# Altium schematic sheet schematic.SchDoc
size 594 x 420 mm
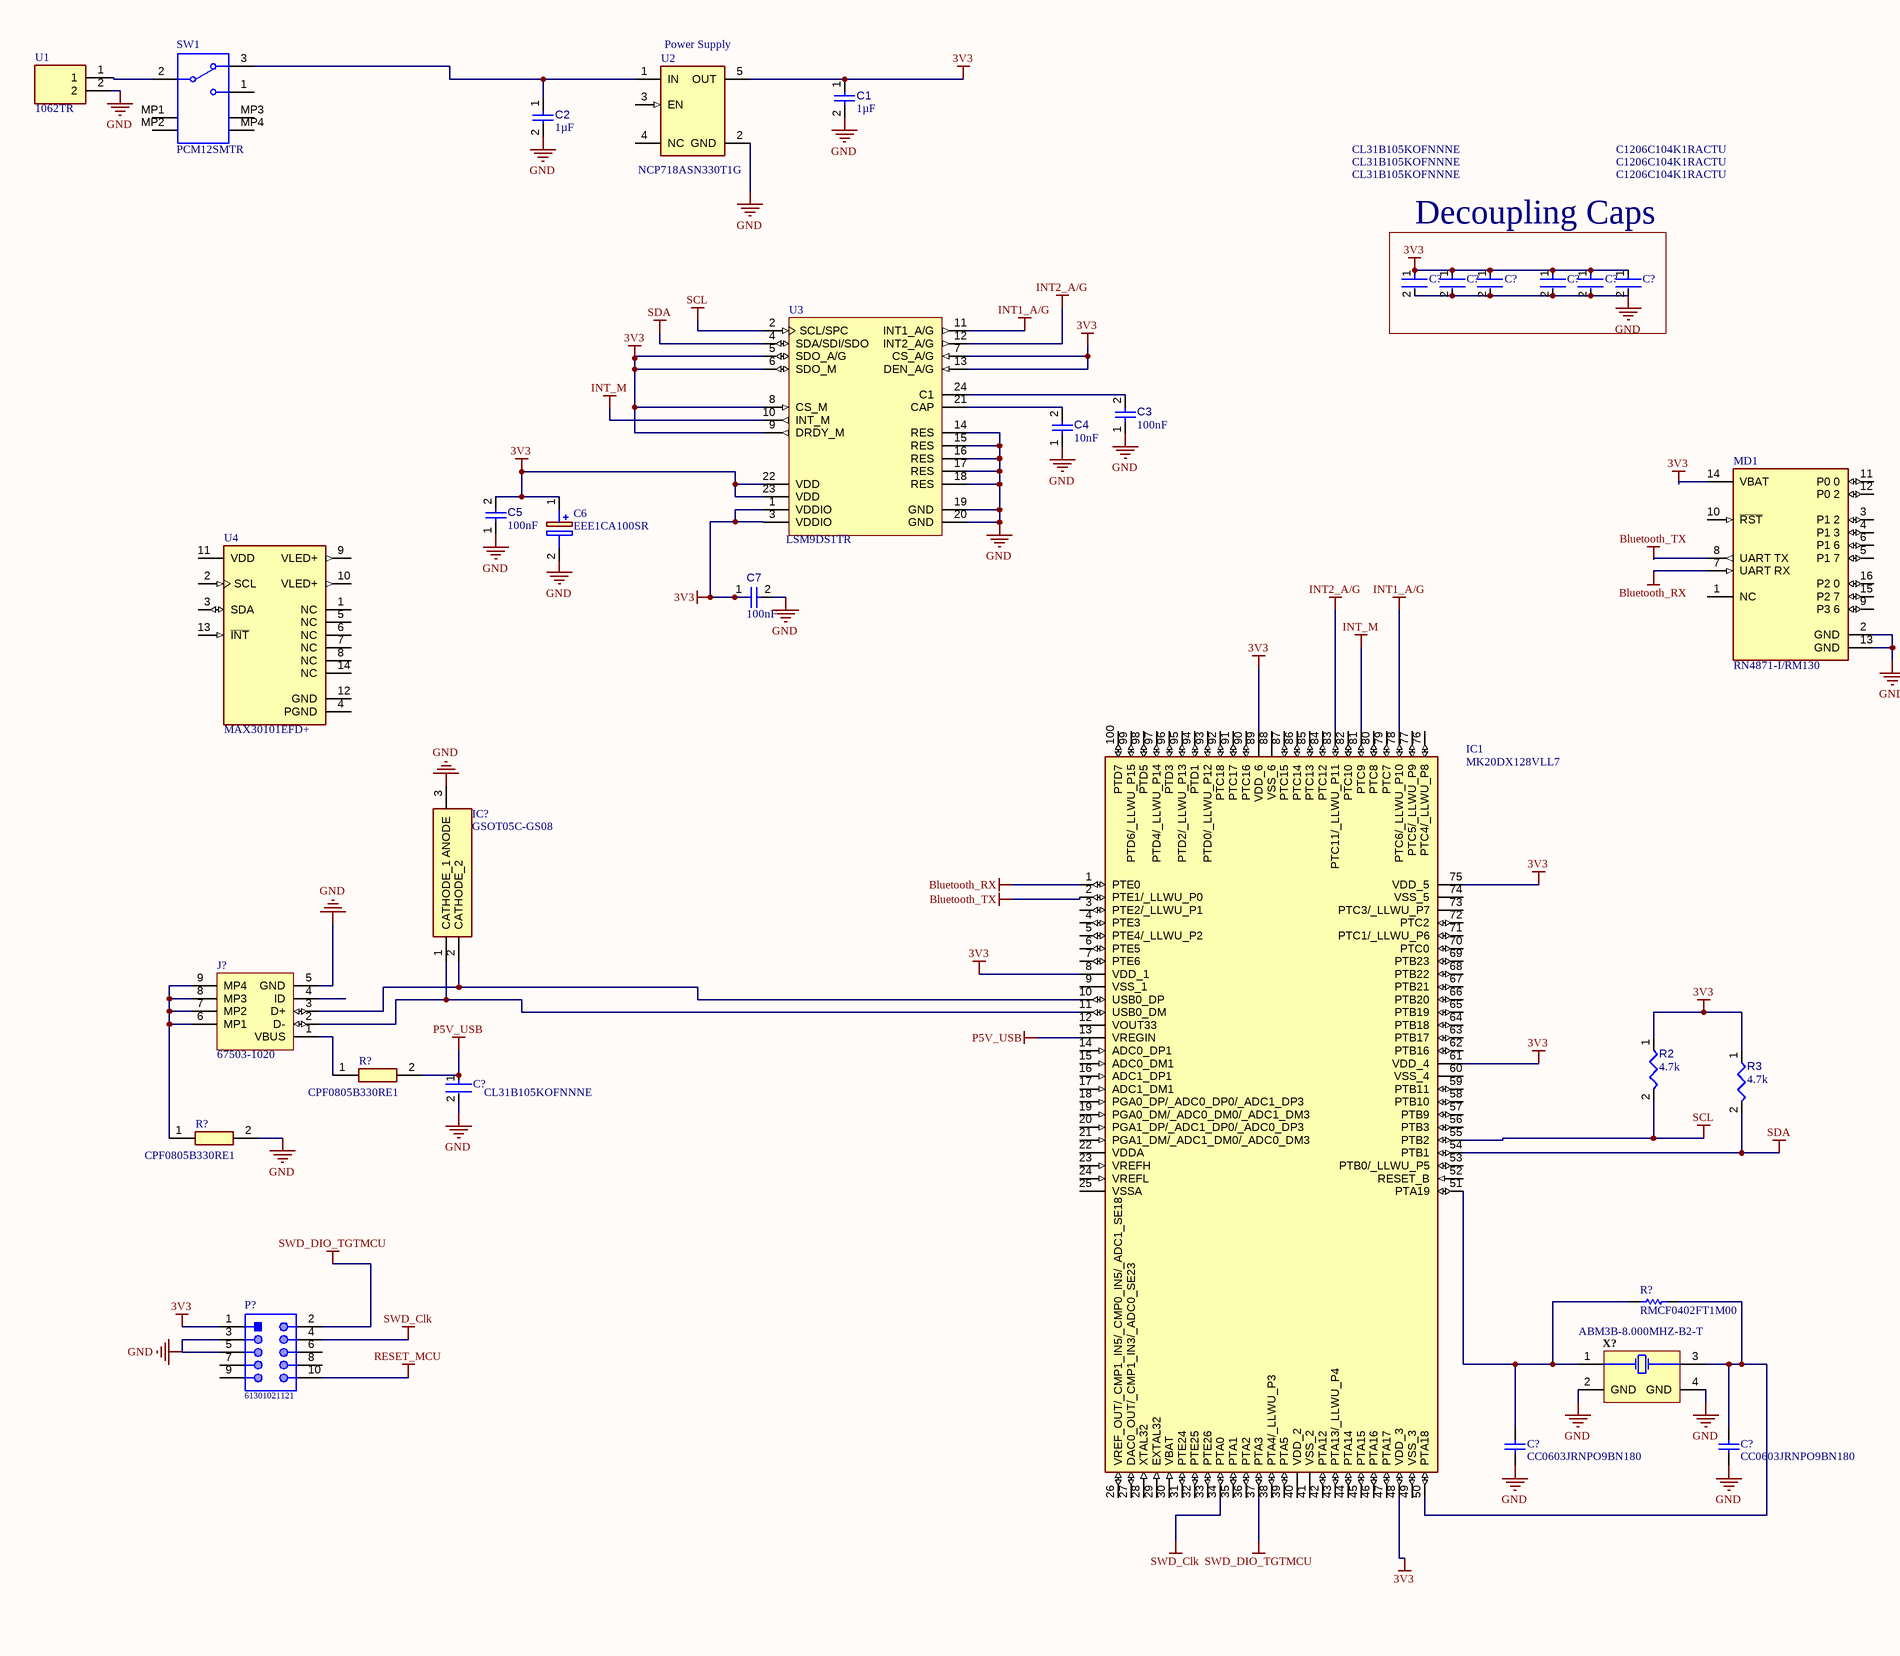
[diagram p0: schematic.SchDoc, left]
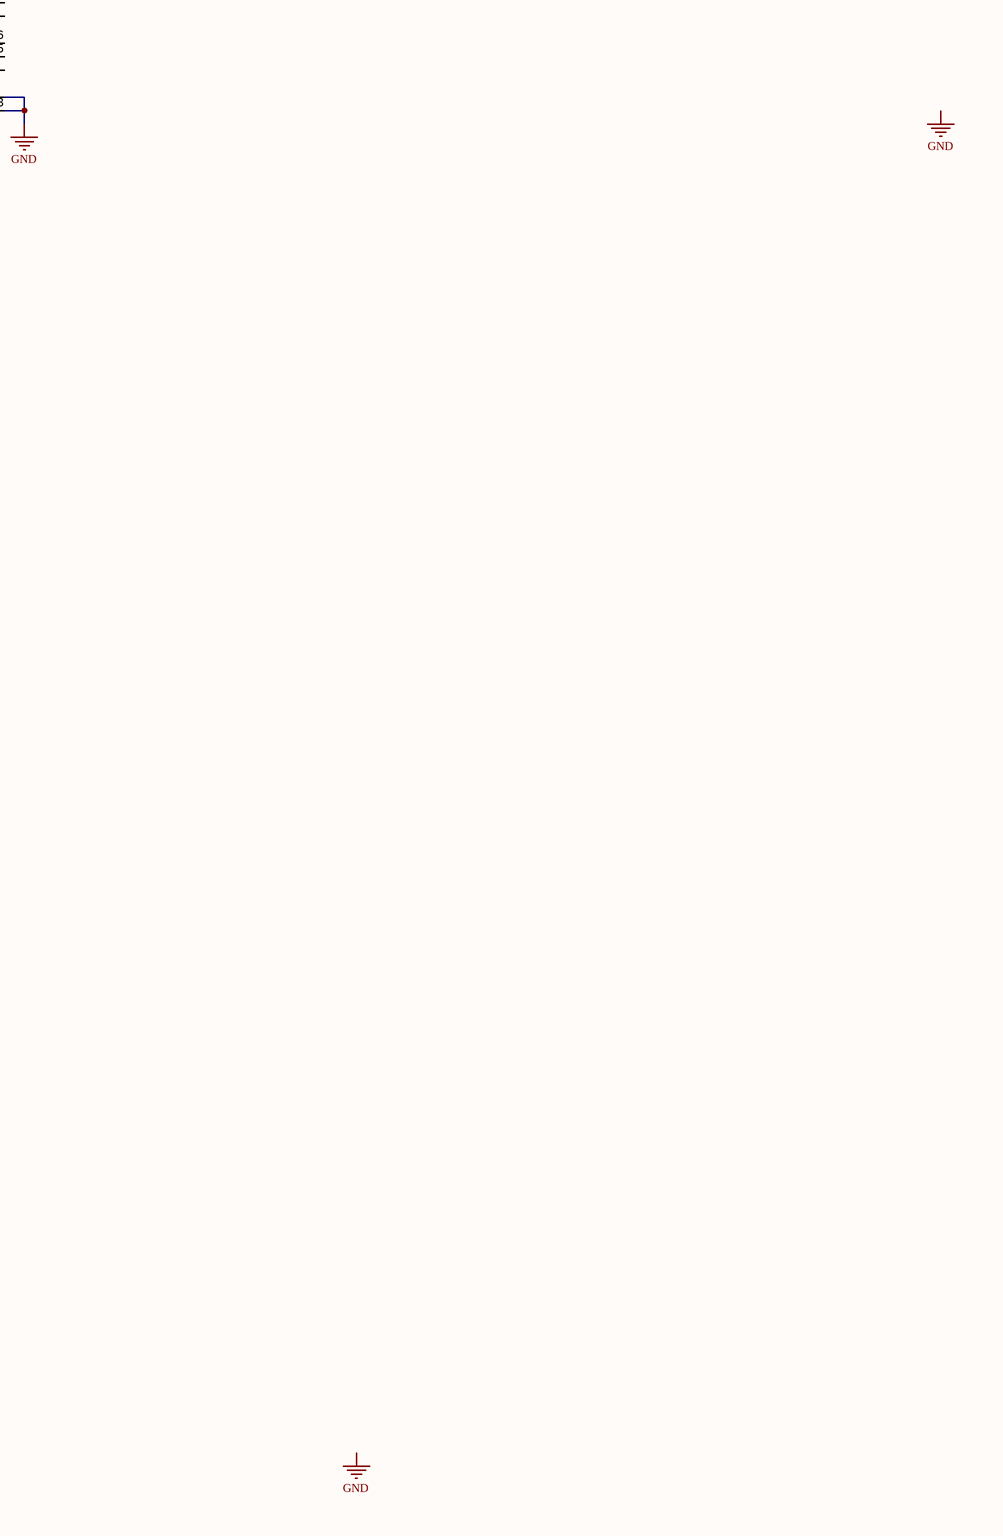
[diagram p1: schematic.SchDoc, right]

## Parts
(Parts that share a designator on the sheet are numbered #1, #2 ... from top to bottom, then left to right.)
C1  value 1µF  [CAPC1608X90X35ML15T15]  (hidden comment: Capacitor 1uF +/- 10% 16V 0603)
C2  value 1µF  [CAPC1608X90X35ML15T15]  (hidden comment: Capacitor 1uF +/- 10% 16V 0603)
C3  value 100nF  [CAPC1608X90X40ML10T20]  (hidden comment: Capacitor 100 nF +/-10% 50 V 0603)
C4  value 10nF  [CAPC0402(1005)60_L]  (hidden comment: Capacitor 10nF +/-20% 50V 0402)
C5  value 100nF  [CAPC1608X90X40ML10T20]  (hidden comment: Capacitor 100 nF +/-10% 50 V 0603)
C6  EEE1CA100SR  [CAPAE430X550N]
C7  value 100nF  [CAPC1608X90X40ML10T20]  (hidden comment: Capacitor 100 nF +/-10% 50 V 0603)
C?#1  CL31B105KOFNNNE  [FP-CL31-IPC_C]
C?#2  CL31B105KOFNNNE  [FP-CL31-IPC_C]
C?#3  CL31B105KOFNNNE  [FP-CL31-IPC_C]
C?#4  C1206C104K1RACTU  [FP-C1206C-EB-MFG]
C?#5  C1206C104K1RACTU  [FP-C1206C-EB-MFG]
C?#6  C1206C104K1RACTU  [FP-C1206C-EB-MFG]
C?#7  CL31B105KOFNNNE  [FP-CL31-IPC_C]
C?#8  CC0603JRNPO9BN180  [CAPC1608X90X40LL10T20]
C?#9  CC0603JRNPO9BN180  [CAPC1608X90X40LL10T20]
IC1  MK20DX128VLL7  [QFP50P1600X1600X170-100N]
IC?  GSOT05C-GS08  [SOT95P248X115-3N]
J?  67503-1020  [MOLX-67503-1020_V]
MD1  RN4871-I/RM130  [FP-RN4871-I-RM130-MFG]
P?  61301021121  [61301021121]
R2  value 4.7k  [RESC1608X55X25ML10T15]  (hidden comment: Resistor 4k7 +/-1% 0603 100 mW)
R3  value 4.7k  [RESC1608X55X25ML10T15]  (hidden comment: Resistor 4k7 +/-1% 0603 100 mW)
R?#1  CPF0805B330RE1  [RESC2012X65N]
R?#2  CPF0805B330RE1  [RESC2012X65N]
R?#3  RMCF0402FT1M00  [RESC1005X40X25LL10T15]
SW1  PCM12SMTR  [CKCP-PCM12SMTR_V]
U1  1062TR  [1062TR]
U2  NCP718ASN330T1G  [FP-419AE-01-IPC_C]
U3  LSM9DS1TR  [STM-LGA-24_3500X3000X1000]
U4  MAX30101EFD+  [FP-F143A5-1-MFG]
X?  ABM3B-8.000MHZ-B2-T  [ABRA-ABM3B_V]

## Blocks framed on the sheet
Decoupling Caps: C?#1-C?#6

## Nets
3V3: C1.1 C5.2 C6.1(+) C7.1 C?#1.1 C?#2.1 C?#3.1 C?#4.1 C?#5.1 C?#6.1 IC1.8(VDD_1) IC1.48(VDD_3) IC1.61(VDD_4) IC1.75(VDD_5) IC1.89(VDD_6) MD1.14(VBAT) P?.1 R2.1 R3.1 U2.5(OUT) U3.1(VDDIO) U3.3(VDDIO) U3.5(SDO_A/G) U3.6(SDO_M) U3.7(CS_A/G) U3.8(CS_M) U3.9(DRDY_M) U3.13(DEN_A/G) U3.22(VDD) U3.23(VDD)
Bluetooth_RX: IC1.1(PTE0) MD1.7(UART_RX)
Bluetooth_TX: IC1.2(PTE1/_LLWU_P0) MD1.8(UART_TX)
GND: C1.2 C2.2 C3.1 C4.1 C5.1 C7.2 C?#1.2 C?#2.2 C?#3.2 C?#4.2 C?#5.2 C?#6.2 C?#7.2 C?#8.1 C?#9.1 J?.5(GND) MD1.2(GND) MD1.13(GND) P?.3 P?.5 R?#2.2 U1.2 U2.2(GND) U3.14(RES) U3.15(RES) U3.16(RES) U3.17(RES) U3.18(RES) U3.19(GND) U3.20(GND) X?.2(GND) X?.4(GND)
INT1_A/G: IC1.78(PTC6/_LLWU_P10) U3.11(INT1_A/G)
INT2_A/G: IC1.83(PTC11/_LLWU_P11) U3.12(INT2_A/G)
INT_M: IC1.81(PTC9) U3.10(INT_M)
P5V_USB: C?#7.1 IC1.13(VREGIN) R?#1.2
RESET_MCU: P?.10
SCL: IC1.55(PTB2) R2.2 U3.2(SCL/SPC)
SDA: IC1.54(PTB1) R3.2 U3.4(SDA/SDI/SDO)
SWD_Clk: IC1.34(PTA0) P?.4
SWD_DIO_TGTMCU: IC1.37(PTA3) P?.2
NetC2_1: C2.1 SW1.3 U2.1(IN)
NetC3_2: C3.2 U3.24(C1)
NetC4_2: C4.2 U3.21(CAP)
NetC?#8_2: C?#8.2 IC1.51(PTA19) R?#3.1 X?.1(X1)
NetC?#9_2: C?#9.2 IC1.50(PTA18) R?#3.2 X?.3(X2)
NetIC1_10: IC1.10(USB0_DP) IC?.2(CATHODE_2) J?.3(D+)
NetIC1_11: IC1.11(USB0_DM) IC?.1(CATHODE_1) J?.2(D-)
NetJ?_1: J?.1(VBUS) R?#1.1
NetJ?_6: J?.6(MP1) J?.7(MP2) J?.8(MP3) J?.9(MP4) R?#2.1
NetSW1_2: SW1.2 U1.1

Not connected (* = marked no-connect by the designer): C6 2(-); IC1 3(PTE2/_LLWU_P1) 4(PTE3) 5(PTE4/_LLWU_P2) 6(PTE5) 7(PTE6) 9(VSS_1) 12(VOUT33) 14(ADC0_DP1) 15(ADC0_DM1) 16(ADC1_DP1) 17(ADC1_DM1) 18(PGA0_DP/_ADC0_DP0/_ADC1_DP3) 19(PGA0_DM/_ADC0_DM0/_ADC1_DM3) 20(PGA1_DP/_ADC1_DP0/_ADC0_DP3) 21(PGA1_DM/_ADC1_DM0/_ADC0_DM3) 22(VDDA) 23(VREFH) 24(VREFL) 25(VSSA) 26(VREF_OUT/_CMP1_IN5/_CMP0_IN5/_ADC1_SE18) 27(DAC0_OUT/_CMP1_IN3/_ADC0_SE23) 28(XTAL32) 29(EXTAL32) 30(VBAT) 31(PTE24) 32(PTE25) 33(PTE26) 35(PTA1) 36(PTA2) 38(PTA4/_LLWU_P3) 39(PTA5) 40(VDD_2) 41(VSS_2) 42(PTA12) 43(PTA13/_LLWU_P4) 44(PTA14) 45(PTA15) 46(PTA16) 47(PTA17) 49(VSS_3) 52(RESET_B) 53(PTB0/_LLWU_P5) 56(PTB3) 57(PTB9) 58(PTB10) 59(PTB11) 60(VSS_4) 62(PTB16) 63(PTB17) 64(PTB18) 65(PTB19) 66(PTB20) 67(PTB21) 68(PTB22) 69(PTB23) 70(PTC0) 71(PTC1/_LLWU_P6) 72(PTC2) 73(PTC3/_LLWU_P7) 74(VSS_5) 76(PTC4/_LLWU_P8) 77(PTC5/_LLWU_P9) 79(PTC7) 80(PTC8) 82(PTC10) 84(PTC12) 85(PTC13) 86(PTC14) 87(PTC15) 88(VSS_6) 90(PTC16) 91(PTC17) 92(PTC18) 93(PTD0/_LLWU_P12) 94(PTD1) 95(PTD2/_LLWU_P13) 96(PTD3) 97(PTD4/_LLWU_P14) 98(PTD5) 99(PTD6/_LLWU_P15) 100(PTD7); IC? 3(ANODE); J? 4(ID); MD1 1(NC) 3(P1_2) 4(P1_3) 5(P1_7) 6(P1_6) 9(P3_6) 10(~{RST}) 11(P0_0) 12(P0_2) 15(P2_7) 16(P2_0); P? 6 7 8 9; SW1 1 MP1 MP2 MP3 MP4; U2 3(EN) 4(NC); U4 1(NC) 2(SCL) 3(SDA) 4(PGND) 5(NC) 6(NC) 7(NC) 8(NC) 9(VLED+) 10(VLED+) 11(VDD) 12(GND) 13(~{INT}) 14(NC)

## Notes on the sheet
- (near U2) Power Supply
- Labels drawn without touching a wire or pin: GND
- 10
- 9
- 8
- 7
- 6
- 5
- 4
- 3
- DWG. NO.
- 2
- 1
- THIS DOCUMENT AND THE DATA DISCLOSED HEREIN OR HEREWITH IS THE PROPERTY OF ALTIUM LIMITED AND MAY BE FREELY DISTRIBUTED IN WHOLE. NO RIGHTS ARE RESERVED OR EXPRESS OR IMPLIED WARANTEE GIVEN.
- REV.
- SHT.
- REVISION
- DESCRIPTION
- DATE
- APPROVED
- H
- G
- F
- E
- D
- C
- B
- A
- TITLE
- SCALE:
- A2
- SIZE
- CAGE CODE
- FILE NAME
- DWG NO.
- SHEET
- OF
- REV

## Library data of the parts
C1 C2 = CMP-001-00004-4: Chip Capacitor, 1 uF, +/- 10%, 16 V, 0603 (1608 Metric); Capacitor Type: Ceramic; Voltage Rating: 16V; Min Operating Temperature: -55°C; Pins: 2; Tolerance: 10%; Case/Package: 0603; Max Operating Temperature: 125°C; Mounting Technology: SM; RoHS Compliant: True
C3 C5 C7 = CMP-001-00017-4: Chip Capacitor, 100 nF, +/- 10%, 50 V, 0603 (1608 Metric); Capacitor Type: Ceramic; Voltage Rating: 50V; RoHS Compliant: True; Max Operating Temperature: 125°C; Pins: 2; Mounting Technology: SM; Min Operating Temperature: -55°C; Tolerance: 10%; Case/Package: 0603
C4 = CMP-001-00069-2: Chip Capacitor, 10nF +/-20%, 50V, 0402, Thickness 0.6 mm; Tolerance: 5%; Voltage Rating: 50V; Pins: 2; Max Operating Temperature: 85°C; Mounting Technology: SMT; Min Operating Temperature: -55°C; Case/Package: 0402
C6 = EEE1CA100SR: Capacitor Polarised; Manufacturer_Name: Panasonic; Datasheet Link: https://industrial.panasonic.com/cdbs/www-data/pdf/RDE0000/ABA0000C1145.pdf; Height: 5.5mm; Manufacturer_Part_Number: EEE1CA100SR; Arrow Part Number: EEE1CA100SR
C?#1-C?#3 C?#7 = CMP-13271-000025-1: Cap Ceramic 1uF 16V X7R ±10% SMD 1206 +125°C Embossed T/R; Package Quantity: 1; Voltage: 16V; Depth: 1.6mm; Thickness: 0.055inch; Contact Plating: Tin; Lead Free: Lead Free; Voltage Rating (DC): 16V; Material: Ceramic; Mount: Surface Mount; Case Code (Metric): 3216; Capacitance: 1uF; Case/Package: 1206; Width: 0.063inch; Voltage Rating: 16V; Height: 1.25mm; Packaging: Tape and Reel; Radiation Hardening: No; Dielectric: X7R; Min Operating Temperature: -55°C; Max Operating Temperature: 125°C; Length: 3.2mm; Tolerance: 10%; Case Code (Imperial): 1206
C?#4-C?#6 = CMP-03020-000153-1: CAP CER 0.1UF 100V X7R 1206; Manufacturer: KEMET; Value: 0.10 μF; Tolerance: 0.1; Material: Ceramic; Temperature Coefficient: 15%; Automotive Grade: Grade 0; Voltage Rating: 100 V; Automotive: Yes; Ipc Land Pattern Name: CAPC320160X78; Device Class L1: Passive Components; ComponentLink2Description: Datasheet; Temperature Range Low: -55°C; Category: Cap; Octopart: https://octopart.com/c1206c104k1ractu-kemet-89521; Height: 0.88mm; Lead Free: Yes; Digikey Description: CAP CER 0.1UF 100V X7R 1206; Mouser Description: CAP CER 0.1UF 100V X7R 1206; Device Class L3: Ceramic Capacitors; Device Class L2: Capacitors; ComponentLink2URL: https://content.kemet.com/datasheets/KEM_C1007_X8R_ULTRA_150C_SMD.pdf; Temperature Range High: +150°C; Temperature Characteristic: X7R; Manufacturer Part Number: C1206C104K1RACTU; RoHS: TRUE; Capacitance: 0.10 μF; Package: C1206C-EB; Temperature: -55°C to +150°C
C?#8 C?#9 = CMP-1659-00030-1: Chip Capacitor, 18 pF, +/- 5%, 50 V, -55 to 125 degC, 0603 (1608 Metric), RoHS, Tape and Reel; Voltage Rating: 50 V; Case\Package: 0603; Power Rating: 100 mW; Resistance: 68.1 Ohm; Tolerance: 1%; Case Code (Metric): 1608; Max Operating Temperature: 155 degC; RoHSCompliant: true; Case Code (Imperial): 0603; ComponentLink2Description: Datasheet; Package Quantity: 200; PackageReference: 0603; ComponentLink2URL: http://www.yageo.com/NewPortal/yageodocoutput?fileName=/pdf/MLCC/UPY-GP_NP0_16V-to-50V_14.pdf; Length: 1.6 mm; DatasheetVersion: Rev. 14, 07/2016; Min Operating Temperature: -55 degC; ComponentLink1URL: http://www.yageo.com/; Width: 0.8 mm; ComponentLink1Description: Manufacturer URL; Height: 0.45 mm; Radiation Hardening: No; PackageDescription: 2-Pin Surface Mount Device, Body 1.6 x 0.8 mm; Packaging: Tape and Reel
IC1 = MK20DX128VLL7: Integrated Circuit; Manufacturer_Name: NXP; Datasheet Link: http://www.nxp.com/docs/en/data-sheet/K20P100M72SF1.pdf; Height: 1.7mm; Manufacturer_Part_Number: MK20DX128VLL7; Arrow Part Number: MK20DX128VLL7; Arrow Price/Stock: https://www.arrow.com/en/products/mk20dx128vll7/nxp-semiconductors; Mouser Part Number: 841-MK20DX128VLL7; Mouser Price/Stock: https://www.mouser.co.uk/ProductDetail/NXP-Semiconductors/MK20DX128VLL7?qs=WtedIhRlNpuHThscd5qw9w%3D%3D
IC? = GSOT05C-GS08: Integrated Circuit; Manufacturer_Name: Vishay; Datasheet Link: https://www.vishay.com/docs/85824/gsot03c.pdf; Height: 1.15mm; Manufacturer_Part_Number: GSOT05C-GS08; Arrow Part Number: GSOT05C-GS08; Mouser Part Number: 78-GSOT05C; Mouser Price/Stock: https://www.mouser.com/Search/Refine.aspx?Keyword=78-GSOT05C
J? = CMP-0411-00002-1: USB, MINI, SMD, RA KME04-USBMU03A01; Manufacturer: Molex; ComponentLink1URL: http://www.molex.com/; PartNumber: 67503-1020; Mounting Technology: Surface Mount; ComponentLink1Description: Manufacturer URL; Terminal Pitch: 0.8 mm; DatasheetVersion: Rev F, 06/2009; ComponentLink2Description: Datasheet; PackageDescription: Mini USB Connector, SMT, Righer Angle; ComponentLink2URL: http://www.molex.com/pdm_docs/sd/675031020_sd.pdf; PackageReference: 67503-1020
MD1 = CMP-06331-000010-1: BLUETOOTH BLE MODULE, SHIELDED,; Manufacturer: Microchip; Sensitivity: -90dBm; Transmitting Current: 10mA; Nominal Supply Current: 80-2230uA; Number Of Gpio: 4; Bandwidth: 78MHz; Data Rate: 10kbits/s; Interface: I2C,SPI,UART,Other; Max Frequency: 2.48GHz; Max Supply Voltage: 3.6V; Min Supply Voltage: 1.9V; RoHS: TRUE; Height: 2.16mm; Manufacturer Part Number: RN4871-I/RM130; ComponentLink2URL: http://ww1.microchip.com/downloads/en/DeviceDoc/RN4870-71-Bluetooth-Low-Energy-Module-Data-Sheet-DS50002489D.pdf; Device Class L1: Integrated Circuits (ICs); Lead Free: Yes; Digikey Description: BLUETOOTH BLE MODULE, SHIELDED,; Package: 0; Temperature Range High: +85°C; ComponentLink2Description: Datasheet; Device Class L3: Transceivers; Temperature: -40°C to +85°C; Mouser Description: Bluetooth Ble Module, Shielded, Antenna, Ascii Interface, 9X11.5Mm 16 Module 11.5X9x2.1 Mm Tray; Receiving Current: 10mA; Category: UNK; Automotive: No; Temperature Range Low: -40°C; Device Class L2: RF Semiconductors and Devices; Octopart: https://octopart.com/rn4871-i%2Frm130-microchip-92006868
P? = CMP-1502-01084-1: THT Vertical Pin Header WR-PHD, Pitch 2.54 mm, Dual Row, 10 pins; Manufacturer: Wurth Elektronik; Working Voltage: 250VAC; Pitch: 2.54mm; Contact Resistance: 20mOhm; Gender: Male; Rated Current: 3A; Withstanding Voltage: 500VAC; Pin Number: 10; Operating Temperature: -40to105degC; Mounting Technology: THT; Publisher: WurthElektronik; Manufacturer URL: http://www.we-online.de; Part Number: 61301021121; Row Number: Dual; Packaging: Bag; Orientation: Vertical; Package Reference: 61301021121; Datasheet URL: https://katalog.we-online.de/em/datasheet/6130xx21121.pdf
R2 R3 = CMP-009-00031-4: Chip Resistor, 4.7 KOhm, +/- 1%, 0.1 W, -55 to 155 degC, 0603 (1608 Metric); Power: 100mW; Max Operating Temperature: 155°C; Tolerance: 1%; Mounting Technology: SM; RoHS Compliant: True; Pins: 2; Case/Package: 0603; Min Operating Temperature: -55°C
R?#1 R?#2 = CPF0805B330RE1: Resistor; Manufacturer_Name: TE Connectivity; Datasheet Link: http://docs-europe.electrocomponents.com/webdocs/13d1/0900766b813d116f.pdf; Height: 0.65mm; Manufacturer_Part_Number: CPF0805B330RE1; Arrow Part Number: CPF0805B330RE1; Mouser Part Number: 279-CPF0805B330RE1; Mouser Price/Stock: https://www.mouser.co.uk/ProductDetail/TE-Connectivity-Holsworthy/CPF0805B330RE1?qs=n4i9pByFsMQlUwq5Q%2FR%2FaQ%3D%3D
R?#3 = CMP-2000-06985-1: Chip Resistor, 1 MOhm, +/- 1%, 63 mW, -55 to 155 degC, 0402 (1005 Metric), RoHS, Tape and Reel; Manufacturer: Stackpole-Electronics-Inc.; Temperature Coefficient: ±100ppm/°C; Power (Watts): 0.063W,1/16W; Resistance (Ohms): 1M; Height: 0.016"(0.40mm); Operating Temperature: -55°C~155°C; Number of Terminations: 2; Features: AutomotiveAEC-Q200; Datasheet Version: 01/2017; Package Reference: 0402; Mounting Technology: SurfaceMount; Category: Resistors; Datasheet URL: https://www.seielect.com/Catalog/SEI-RMCF_RMCP.pdf; Family: ChipResistor-SurfaceMount; Series: RMCF; Size / Dimension: 0.039"Lx0.020"W(1.00mmx0.50mm); Supplier Device Package: 0402; Package / Case: 0402(1005Metric); Composition: ThickFilm; Package Description: 2-Pin Surface Mount Device, Body 1 x 0.5 mm; Packaging: CutTape(CT); Tolerance: ±1%; Manufacturer URL: https://www.seielect.com/
SW1 = CMP-2000-06884-1: Ultraminiature Slide Switch, SPDT, 0.3 A, 6 V, -20 to 85 degC, 3-Pin SMD, RoHS, Tape and Reel; Manufacturer: C&K Components; Switch Operation: On-On; Contact Current-Max: 0.3A; Datasheet Version: 02/2016; Package Reference: PCM12SMTR; Package Description: 3-Pin Surface Mount Device, Body 6.7 x 2.6 mm; Contact Material: SilverOverCopper; Mounting Technology: SurfaceMount; Circuitry: SPDT; Datasheet URL: http://www.ck-components.com/media/1424/pcm.pdf; Termination Style: RightAngle/SurfaceMount; Manufacturer URL: http://www.ckswitches.com/
U1 = 1062TR: Undefined or Miscellaneous; Manufacturer_Name: Keystone Electronics; Datasheet Link: https://www.keyelco.com/product-pdf.cfm?p=3849; Height: 10.31mm; Manufacturer_Part_Number: 1062TR; Arrow Part Number: 1062TR; Mouser Part Number: 534-1062TR; Mouser Price/Stock: https://www.mouser.co.uk/ProductDetail/Keystone-Electronics/1062TR?qs=%252BeqmunvUw%2FWNoGZeA9V7vw%3D%3D
U2 = CMP-07128-000009-1: 300 MA LOW IQ WIDE INPUT; Manufacturer: ON Semiconductor; Output Current: 800mA; Accuracy Percentage: 2%; Max Junction Temp: +150°C; Standoff Height: 0.01mm; Number Of Outputs: 1; Nominal Supply Current: 4uA; Max Supply Voltage: 24V; Min Supply Voltage: 2.5V; Output Type: Fixed; Output Voltage: 3.3V; Dropout Voltage: 275mV; Octopart: https://octopart.com/ncp718asn330t1g-on+semiconductor-87658778; Category: IC; Mouser Description: LDO Regulator, 300 mA, Wide Vin, Ultra-Low Iq Fixed 3.3V, Active Discharge, TSOT23-5; ComponentLink2Description: Datasheet; Height: 1mm; Device Class L2: Power Management ICs; Device Class L1: Integrated Circuits (ICs); ComponentLink2URL: https://www.onsemi.com/pub/Collateral/NCP718-D.PDF; Lead Free: Yes; Ipc Land Pattern Name: SOT95P280X100-5; Temperature Range High: +150°C; Device Class L3: Voltage Regulators - Linear; Package: 419AE-01; Digikey Description: 300 MA LOW IQ WIDE INPUT; Footprint Url: https://www.onsemi.com/pub/Collateral/419AE.PDF; Manufacturer Part Number: NCP718ASN330T1G; Automotive: No; Temperature: to +150°C; RoHS: TRUE
U3 = CMP-2000-06606-1: iNEMO Inertial Module: 3D Accelerometer, 3D Gyroscope, 3D Magnetometer, 1.9 to 3.6 V, -40 to 85 degC, 24-Pin LGA, RoHS, Tape and Reel; Manufacturer: STMicroelectronics; SVHC: NoSVHC(17-Dec-2015); MEMS Module Function: Tri-AxisGyroscope,Tri-AxisAccelerometer,Tri-AxisMagnetometer; Supply Voltage Max: 3.6V; No. of Pins: 24Pins; Gyroscope Range: ±245°/s,±500°/s,±2000°/s; Acceleration Range: ±2g,±4g,±8g,±16g; Supply Voltage Min: 1.9V; Package Description: 24-Pin Plastic Land Grid Array Package, Body 3.65 x 3.15 mm, Pitch 0.43 mm; Manufacturer URL: http://www.st.com/; PartNumber: LSM9DS1; Product Range: -; Packaging: CutTape; Sensor Case Style: LGA; Datasheet URL: http://www2.st.com/content/ccc/resource/technical/document/datasheet/1e/3f/2a/d6/25/eb/48/46/DM00103319.pdf/files/DM00103319.pdf/jcr:content/translations/en.DM00103319.pdf; Package Reference: LGA-24_3500X3000X1000; Mounting Technology: SurfaceMount; Datasheet Version: Rev. 3, 03/2015; MSL: MSL3-168hours
U4 = CMP-05738-000001-1: INTEGRATED OPTICAL SENSOR; Manufacturer: Maxim Integrated; Max Supply Voltage: 2V; Max Junction Temp: +90°C; Operating Supply Current: 600uA; Min Supply Voltage: 1.7V; Sensor Output: I2C; RoHS: TRUE; Footprint Url: https://pdfserv.maximintegrated.com/land_patterns/90-0602.PDF; Manufacturer Part Number: MAX30101EFD+; Device Class L2: unset; Temperature Range Low: -40°C; Automotive: No; Height: 1.65mm; Temperature Range High: +85°C; ComponentLink2Description: Datasheet; Mouser Description: INTEGRATED OPTICAL SENSOR; ComponentLink2URL: https://datasheets.maximintegrated.com/en/ds/MAX30101.pdf; Octopart: https://octopart.com/max30101efd%2B-maxim+integrated-57054333; Temperature: -40°C to +85°C; Package: F143A5-1; Lead Free: Yes; Device Class L1: Sensors; Digikey Description: INTEGRATED OPTICAL SENSOR; Category: IC; Device Class L3: unset
X? = CMP-1688-00002-1: Ceramic SMD Crystal, 8 MHz, +/- 20 ppm, 200 Ohm, -20 to 70 degC, 4-Pin SMD, RoHS, Tape and Reel; Max Supply Voltage: 45 V; Outputs: 4; Min Supply Voltage: 8.2 V; Output Voltage: 3.3 V; Switching Frequency: 30 KHz; Output Current: 1.8 A; Packaging: Rail/Tube; ComponentLink2Description: Datasheet; REACH SVHC: No SVHC; ComponentLink1URL: http://www.abracon.com/; PackageReference: ABM3B; Weight: 0.004233 oz; Height: 1.05 mm; ComponentLink2URL: http://www.abracon.com/Resonators/abm3b.pdf; Mount: Surface Mount; Min Operating Temperature: -40 degC; Max Operating Temperature: 85 degC; Package Quantity: 50; PackageDescription: 4-Pin Surface Mount Device, Body 5 x 3.2 mm; Pins: 28; DatasheetVersion: Aug-15; ComponentLink1Description: Manufacturer URL; RoHSCompliant: true; Radiation Hardening: No; Length: 9.8 mm; Width: 4.5 mm